# Altium project MCU_Board_fNIRS.PrjPcb
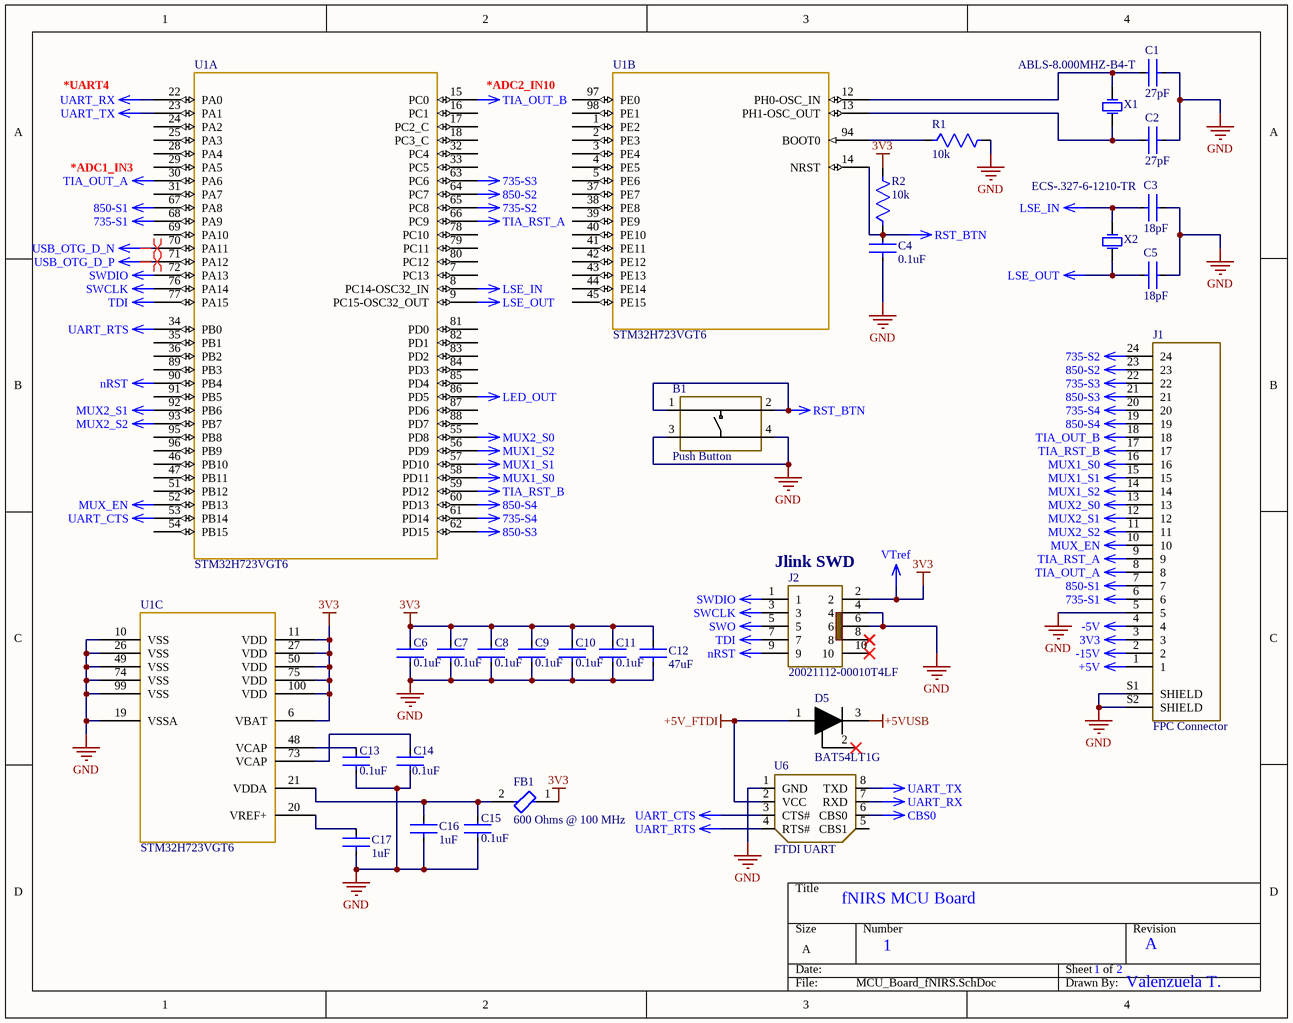
[diagram p0: MCU_Board_fNIRS.SchDoc]
2 sheets, 53 parts. Net scope: global (net labels, ports and power ports of the same name join across sheets).
Board file: MCU_Board_fNIRS.PcbDoc
Sheets:
  MCU_Board_fNIRS.SchDoc
  MCU_Board_fNIRS_POWER.SchDoc

## Sheet MCU_Board_fNIRS.SchDoc
size A; SheetNumber: 1; SheetTotal: 2

### Parts
B1  Push Button  [PTS810]
C1  27pF  [CAPC3216X180N]
C2  27pF  [CAPC3216X180N]
C3  18pF  [CAPC3216X180N]
C4  0.1uF  [CAPC3216X180N]
C5  18pF  [CAPC3216X180N]
C6  0.1uF  [CAPC3216X180N]
C7  0.1uF  [CAPC3216X180N]
C8  0.1uF  [CAPC3216X180N]
C9  0.1uF  [CAPC3216X180N]
C10  0.1uF  [CAPC3216X180N]
C11  0.1uF  [CAPC3216X180N]
C12  47uF  [CAPC3216X180N]
C13  0.1uF  [CAPC3216X180N]
C14  0.1uF  [CAPC3216X180N]
C15  0.1uF  [CAPC3216X180N]
C16  1uF  [CAPC1206(3216)130_M]
C17  1uF  [CAPC1206(3216)130_M]
D5  BAT54LT1G  [BAT54LT1]
FB1  600 Ohms @ 100 MHz  [BEADC1608X95N]
J1  FPC Connector  [TE_FPC]
J2  20021112-00010T4LF  [AMPHENOL_20021112-00010T4LF]
R1  10k  [R1206]
R2  10k  [R1206]
U1  STM32H723VGT6  [LQFP100_STM]  (parts A,B,C of 3)
U6  FTDI UART  [UB232R]
X1  ABLS-8.000MHZ-B4-T  [ABRA-ABLS-14.7456MHZ-B2-T_V]
X2  ECS-.327-6-1210-TR  [ECS-.327-6-1210-TR]

### Nets
3V3: C6.2 C7.2 C8.2 C9.2 C10.2 C11.2 C12.2 FB1.1 J1.3 J2.2 R2.2 U1.6(VBAT) U1.11(VDD) U1.27(VDD) U1.50(VDD) U1.75(VDD) U1.100(VDD)  [also labelled VTref]
735-S1: J1.6 U1.68(PA9)
735-S2: J1.24 U1.65(PC8)
735-S3: J1.22 U1.63(PC6)
735-S4: J1.20 U1.61(PD14)
850-S1: J1.7 U1.67(PA8)
850-S2: J1.23 U1.64(PC7)
850-S3: J1.21 U1.62(PD15)
850-S4: J1.19 U1.60(PD13)
+5V: J1.1
+5V_FTDI: D5.1(A) U6.2(VCC)
+5VUSB: D5.3(K)
-5V: J1.4
-15V: J1.2
CBS0: U6.6(CBS0)
GND: B1.3 B1.4 C1.1 C2.1 C3.2 C4.1 C5.2 C6.1 C7.1 C8.1 C9.1 C10.1 C11.1 C12.1 C13.1 C14.1 C15.1 C16.1 C17.1 J1.5 J1.S1(SHIELD) J1.S2(SHIELD) J2.4 J2.6 R1.2 U1.10(VSS) U1.19(VSSA) U1.26(VSS) U1.49(VSS) U1.74(VSS) U1.99(VSS) U6.1(GND)
LED_OUT: U1.86(PD5)
LSE_IN: C3.1 U1.8(PC14-OSC32_IN) X2.2(X2)
LSE_OUT: C5.1 U1.9(PC15-OSC32_OUT) X2.1(X1)
MUX1_S0: J1.16 U1.58(PD11)
MUX1_S1: J1.15 U1.57(PD10)
MUX1_S2: J1.14 U1.56(PD9)
MUX2_S0: J1.13 U1.55(PD8)
MUX2_S1: J1.12 U1.92(PB6)
MUX2_S2: J1.11 U1.93(PB7)
MUX_EN: J1.10 U1.52(PB13)
nRST: J2.9 U1.90(PB4)
RST_BTN: B1.1 B1.2 C4.2 R2.1 U1.14(NRST)
SWCLK: J2.3 U1.76(PA14)
SWDIO: J2.1 U1.72(PA13)
SWO: J2.5
TDI: J2.7 U1.77(PA15)
TIA_OUT_A: J1.8 U1.30(PA6)
TIA_OUT_B: J1.18 U1.15(PC0)
TIA_RST_A: J1.9 U1.66(PC9)
TIA_RST_B: J1.17 U1.59(PD12)
UART_CTS: U1.53(PB14) U6.3(CTS#)
UART_RTS: U1.34(PB0) U6.4(RTS#)
UART_RX: U1.22(PA0) U6.7(RXD)
UART_TX: U1.23(PA1) U6.8(TXD)
USB_OTG_D_N: U1.70(PA11)
USB_OTG_D_P: U1.71(PA12)
NetC1_2: C1.2 U1.12(PH0-OSC_IN) X1.1(X1)
NetC2_2: C2.2 U1.13(PH1-OSC_OUT) X1.2(X2)
NetC13_2: C13.2 U1.48(VCAP)
NetC14_2: C14.2 U1.73(VCAP)
NetC15_2: C15.2 C16.2 FB1.2 U1.21(VDDA)
NetC17_2: C17.2 U1.20(VREF+)
NetR1_1: R1.1 U1.94(BOOT0)

Not connected (* = marked no-connect by the designer): D5 2(NC)*; J2 8* 10*; U1 1(PE2) 2(PE3) 3(PE4) 4(PE5) 5(PE6) 7(PC13) 16(PC1) 17(PC2_C) 18(PC3_C) 24(PA2) 25(PA3) 28(PA4) 29(PA5) 31(PA7) 32(PC4) 33(PC5) 35(PB1) 36(PB2) 37(PE7) 38(PE8) 39(PE9) 40(PE10) 41(PE11) 42(PE12) 43(PE13) 44(PE14) 45(PE15) 46(PB10) 47(PB11) 51(PB12) 54(PB15) 69(PA10) 78(PC10) 79(PC11) 80(PC12) 81(PD0) 82(PD1) 83(PD2) 84(PD3) 85(PD4) 87(PD6) 88(PD7) 89(PB3) 91(PB5) 95(PB8) 96(PB9) 97(PE0) 98(PE1); U6 5(CBS1)

### Layout directives
differential pair: USB_OTG_D_N, USB_OTG_D_P

### Notes on the sheet
- *UART4
- (near U1) *ADC2_IN10
- *ADC1_IN3
- (near J2) Jlink SWD
- fNIRS MCU Board
- 1
- 2
- A
- Valenzuela T.

### Library data of the parts
B1 = PTS810 SJG 250 SMTR LFS: Tactile Switch SPST-NO Top Actuated Surface Mount
C1 C2 = C1206C270K5GAC7800: CAP CER 27PF 50V C0G/NP0 1206; Tolerance: -20% to +80%; Value: 1uF; Case-Metric: 3216; Rated Voltage: 25 V; Case-EIA: 1206; Max Thickness: 1.3 mm; Technology: SMT
C3 C5 = C1206C180J5GAC7800: 18 pF ±5% 50V Ceramic Capacitor C0G, NP0 1206 (3216 Metric); Tolerance: -20% to +80%; Value: 1uF; Case-Metric: 3216; Rated Voltage: 25 V; Case-EIA: 1206; Max Thickness: 1.3 mm; Technology: SMT
C4 C6-C11 C13-C15 = C1206C104K5RAC7210: 1206; Manufacturer: KEMET; Tolerance: 0.1; Material: Ceramic; Voltage Rating: 50 V; Temperature Characteristic: X7R; Automotive Grade: Grade 0; Capacitance: 0.10 μF; Value: 0.10 μF; Temperature Coefficient: 15%; Device Class L3: Ceramic Capacitors; ComponentLink2URL: https://content.kemet.com/datasheets/KEM_C1007_X8R_ULTRA_150C_SMD.pdf; Temperature Range Low: -55°C; RoHS: TRUE; Temperature Range High: +150°C; Automotive: Yes; Height: 0.88mm; Manufacturer Part Number: C1206C104K5RAC7210; Temperature: -55°C to +150°C; Octopart: https://octopart.com/c1206c104k5rac7210-kemet-3919856; Package: C1206C-EB; Mouser Description: Multilayer Ceramic Capacitors MLCC - SMD/SMT 50volts 0.1uF X7R 10%; Ipc Land Pattern Name: CAPC320160X78; Device Class L2: Capacitors; Category: Cap; Lead Free: Yes; ComponentLink2Description: Datasheet; Digikey Description: CAP CER 0.1UF 50V X7R 1206; Device Class L1: Passive Components
C12 = CL31A476MQHNNWE: 47 µF ±20% 6.3V Ceramic Capacitor X5R 1206 (3216 Metric); Tolerance: -20% to +80%; Value: 1uF; Case-Metric: 3216; Rated Voltage: 25 V; Case-EIA: 1206; Max Thickness: 1.3 mm; Technology: SMT
C16 = 12063G105ZAT4A_1: CAP 1uF 25V -20% to +80% 1206 (3216 Metric) Thickness 1.3mm SMD / C1206C105Z3VAC7800; Case-Metric: 3216; Case-EIA: 1206; Tolerance: -20% to +80%; Value: 1uF; Max Thickness: 1.3 mm; Technology: SMT; Rated Voltage: 25 V
C17 = 12063G105ZAT4A_1: CAP 1uF 25V -20% to +80% 1206 (3216 Metric) Thickness 1.3mm SMD; Case-Metric: 3216; Case-EIA: 1206; Tolerance: -20% to +80%; Value: 1uF; Max Thickness: 1.3 mm; Technology: SMT; Rated Voltage: 25 V
D5 = BAT54L: Schottky Barrier Diode, 3-Pin SOT-23, Pb-Free, Tape and Reel; Manufacturer: On Semiconductor; IFSM Max (A): 0.6; Configuration: Single; trr Max (ns): 5; PackageVersion: Rev. AP, 11/2009; ComponentLink3Description: Package Specification; RoHS: TRUE; ComponentLink3URL: http://www.onsemi.cn/pub_link/Collateral/318-08.PDF; PackageDescription: 3-Pin Small Outline Transistor, Body 2.92 x 1.3 mm, Pitch 0.95 mm; DatasheetVersion: Rev. 12; ComponentLink1Description: Manufacturer URL; PartNumber: BAT54LT1G; ComponentLink2Description: Datasheet; Mounting Technology: Surface Mount; PackageReference: SOT-23-3-318-08; ComponentLink2URL: http://www.onsemi.cn/pub_link/Collateral/BAT54LT1-D.PDF; ComponentLink1URL: http://www.onsemi.com/; Packing: Tape and Reel
FB1 = FCM 1608KF-601T03: 600 Ohms @ 100 MHz 1 Ferrite Bead 0603 (1608 Metric) 350mA 500mOhm; Tolerance: -20% to +80%; Value: 1uF; Case-Metric: 3216; Rated Voltage: 25 V; Case-EIA: 1206; Max Thickness: 1.3 mm; Technology: SMT
J1 = 2-1734592-4: 24 Position FPC Connector Contacts, Bottom 0.020" _0.50mm_ Surface Mount, Right Angle; MF: TE Connectivity; MP: 2-1734592-4; Value: *; Package: None; Price: None; SnapEDA_Link: https://www.snapeda.com/parts/2-1734592-4/TE%20Connectivity/view-part/4788511/?ref=snap; Availability: Unavailable
J2 = 20021112-00010T4LF: Connector Header Through Hole, Right Angle 10 position 0.050" (1.27mm); MF: Amphenol; Package: None; Price: None; Check_prices: https://www.snapeda.com/parts/20021112-00010T4LF/Amphenol/view-part/?ref=eda; Value: *; SnapEDA_Link: https://www.snapeda.com/parts/20021112-00010T4LF/Amphenol/view-part/?ref=snap; MP: 20021112-00010T4LF; Availability: In Stock; Purchase-URL: https://pricing.snapeda.com/search?q=20021112-00010T4LF&ref=eda
R1 R2 = RC1206FR-0710KL: 1206 10kOhm
U1 = STM32H723VGT6: No Description Available; Mfr_Name: STMicroelectronics; RefDes: RefDes; Type: Type
U6 = UB232R: FT232R - USB 2.0 to UART (RS232) Bridge Interface Evaluation Board
X1 = ABLS-8.000MHZ-B4-T: Low Profile Crystal, 8.0 MHz, +/- 30 ppm, -20 to 70 degC, 2-Pin SMD, RoHS, Tape and Reel; Brand: ABRACON; Case Length: 11.4mm; Frequency Stability: 50PPM; ESR: 80Ohms; Case Height: 4.2mm; Tolerance: 30PPM; Frequency: 8MHz; Case Width: 4.7mm; Load Capacitance: 18pF; Datasheet Version: 04/2011; Termination Style: SMD/SMT; Dimensions: 4.7mmWx11.4mmLx4.2mmH; Packaging: Reel; Manufacturer: ABRACON; Package URL: http://www.abracon.com/Support/PackageDrawing/Resonators/ABLS-2D.pdf; Mounting Technology: SurfaceMount; Package Reference: ABLS-14.7456MHZ-B2-T; Product Category: Crystals; Package Description: 2-Pin Surface Mount Device, Body 11.4 x 4.7 mm; Package / Case: HC-49/US; Mounting Style: SMD/SMT; Operating Temperature Range: -20Cto+70C; Series: ABLS; Factory Pack Quantity: 1000; Datasheet URL: http://www.abracon.com/Resonators/abls.pdf; Manufacturer URL: http://www.abracon.com/; RoHS: Details; Type: LowProfileMicroprocessorCrystal
X2 = ECS-.327-6-1210-TR: Low Profile Crystal, 8.0 MHz, +/- 30 ppm, -20 to 70 degC, 2-Pin SMD, RoHS, Tape and Reel; Brand: ABRACON; Case Length: 11.4mm; Frequency Stability: 50PPM; ESR: 80Ohms; Case Height: 4.2mm; Tolerance: 30PPM; Frequency: 8MHz; Case Width: 4.7mm; Load Capacitance: 18pF; Datasheet Version: 04/2011; Termination Style: SMD/SMT; Dimensions: 4.7mmWx11.4mmLx4.2mmH; Packaging: Reel; Manufacturer: ABRACON; Package URL: http://www.abracon.com/Support/PackageDrawing/Resonators/ABLS-2D.pdf; Mounting Technology: SurfaceMount; Package Reference: ABLS-14.7456MHZ-B2-T; Product Category: Crystals; Package Description: 2-Pin Surface Mount Device, Body 11.4 x 4.7 mm; Package / Case: HC-49/US; Mounting Style: SMD/SMT; Operating Temperature Range: -20Cto+70C; Series: ABLS; Factory Pack Quantity: 1000; Datasheet URL: http://www.abracon.com/Resonators/abls.pdf; Manufacturer URL: http://www.abracon.com/; RoHS: Details; Type: LowProfileMicroprocessorCrystal

## Sheet MCU_Board_fNIRS_POWER.SchDoc
size A; SheetNumber: 2; SheetTotal: 2
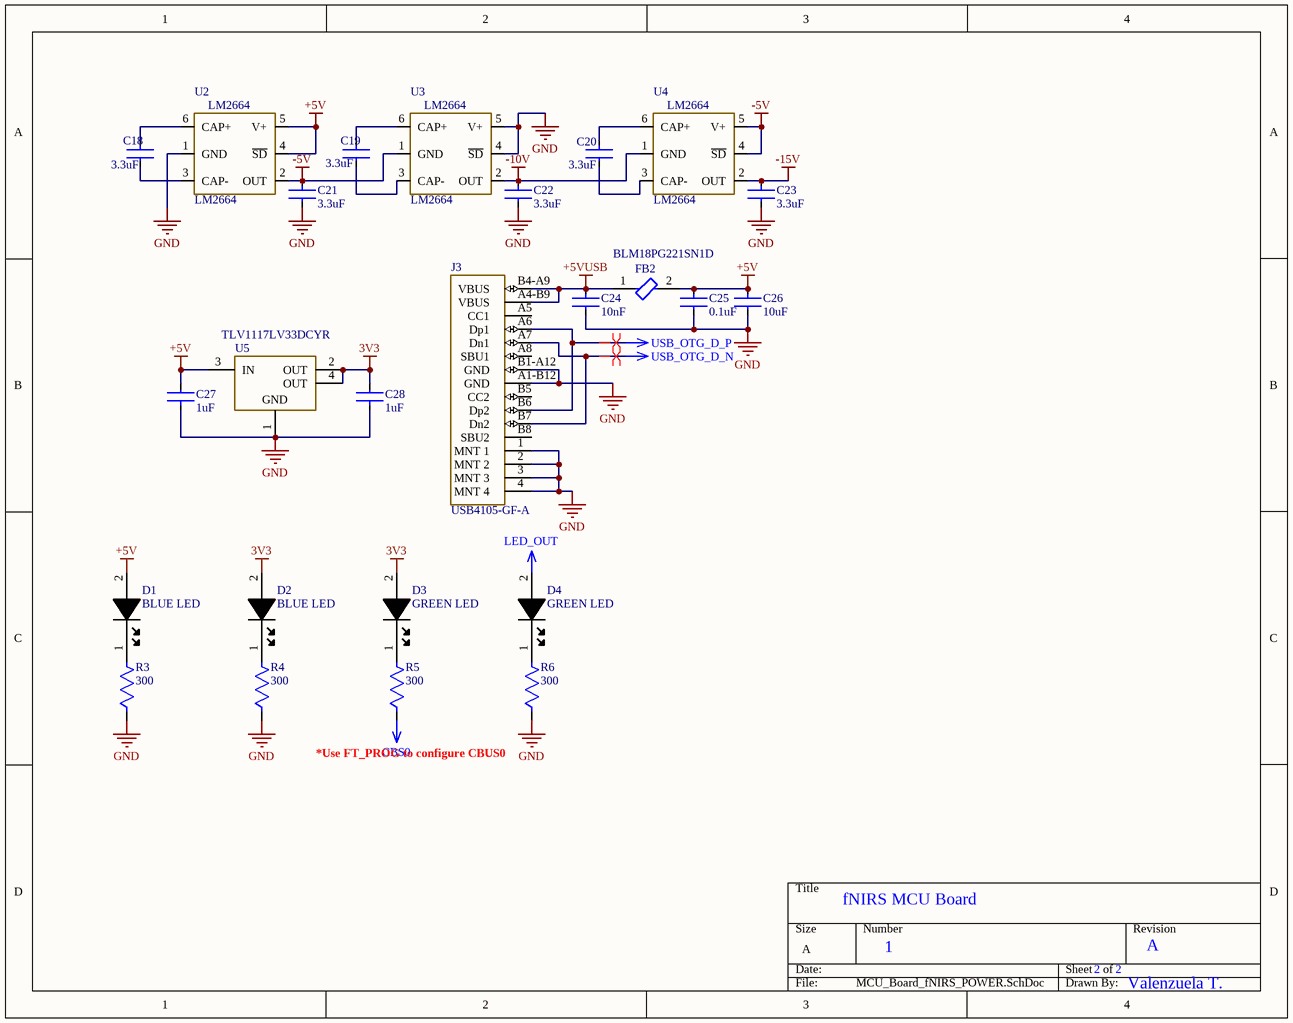
[diagram p1: MCU_Board_fNIRS_POWER.SchDoc]

### Parts
C18  3.3uF  [CAPC1210(3225)190_M]
C19  3.3uF  [CAPC1210(3225)190_M]
C20  3.3uF  [CAPC1210(3225)190_M]
C21  3.3uF  [CAPC1210(3225)190_M]
C22  3.3uF  [CAPC1210(3225)190_M]
C23  3.3uF  [CAPC1210(3225)190_M]
C24  10nF  [CAPC1206(3216)130_M]
C25  0.1uF  [CAPC3216X180N]
C26  10uF  [CAPC3216X180N]
C27  1uF  [CAPC3216X180N]
C28  1uF  [CAPC3216X180N]
D1  BLUE LED  [XZCFBB54W-1VF]
D2  BLUE LED  [XZCFBB54W-1VF]
D3  GREEN LED  [XZCFBB54W-1VF]
D4  GREEN LED  [XZCFBB54W-1VF]
FB2  BLM18PG221SN1D  [BEADC1608X95N]
J3  USB4105-GF-A  [FP-USB4105-GF-A-MFG]
R3  300  [R1206]
R4  300  [R1206]
R5  300  [R1206]
R6  300  [R1206]
U2  LM2664  [LM2664]
U3  LM2664  [LM2664]
U4  LM2664  [LM2664]
U5  TLV1117LV33DCYR  [DCY0004A_M]

### Nets
3V3: C28.2 D2.2 D3.2 U5.2(OUT) U5.4(OUT)
+5V: C25.1 C26.1 C27.2 D1.2 FB2.2 U2.4(~{SD}) U2.5(V+) U5.3(IN)
+5VUSB: C24.1 FB2.1 J3.A4-B9(VBUS) J3.B4-A9(VBUS)
-5V: C21.1 U2.2(OUT) U3.1(GND) U4.4(~{SD}) U4.5(V+)
-10V: C22.1 U3.2(OUT) U4.1(GND)
-15V: C23.1 U4.2(OUT)
CBS0: R5.1
GND: C21.2 C22.2 C23.2 C24.2 C25.2 C26.2 C27.1 C28.1 J3.1(MNT_1) J3.2(MNT_2) J3.3(MNT_3) J3.4(MNT_4) J3.A1-B12(GND) J3.B1-A12(GND) R3.1 R4.1 R6.1 U2.1(GND) U3.4(~{SD}) U3.5(V+) U5.1(GND)
LED_OUT: D4.2
USB_OTG_D_N: J3.A7(Dn1) J3.B7(Dn2)
USB_OTG_D_P: J3.A6(Dp1) J3.B6(Dp2)
NetC18_1: C18.1 U2.6(CAP+)
NetC18_2: C18.2 U2.3(CAP-)
NetC19_1: C19.1 U3.6(CAP+)
NetC19_2: C19.2 U3.3(CAP-)
NetC20_1: C20.1 U4.6(CAP+)
NetC20_2: C20.2 U4.3(CAP-)
NetD1_1: D1.1 R3.2
NetD2_1: D2.1 R4.2
NetD3_1: D3.1 R5.2
NetD4_1: D4.1 R6.2

Not connected (* = marked no-connect by the designer): J3 A5(CC1) A8(SBU1) B5(CC2) B8(SBU2)

### Layout directives
differential pair: USB_OTG_D_N, USB_OTG_D_P

### Notes on the sheet
- *Use FT_PROG to configure CBUS0
- fNIRS MCU Board
- 1
- 2
- A
- Valenzuela T.

### Library data of the parts
C18-C23 = C1210C335K5RAC7800: 1210
C24 = C1206C103KMREC7800: 10000 pF ±10% 63V Ceramic Capacitor X7R 1206 (3216 Metric); Tolerance: -20% to +80%; Value: 1uF; Case-Metric: 3216; Rated Voltage: 25 V; Case-EIA: 1206; Max Thickness: 1.3 mm; Technology: SMT
C25 = C1206C104K5RAC7210: as C4 on sheet MCU_Board_fNIRS; Device Class L3: Ceramic Capacitors; ComponentLink2URL: https://content.kemet.com/datasheets/KEM_C1007_X8R_ULTRA_150C_SMD.pdf; Temperature Range Low: -55°C; RoHS: TRUE; Temperature Range High: +150°C; Automotive: Yes; Height: 0.88mm; Manufacturer Part Number: C1206C104K5RAC7210; Temperature: -55°C to +150°C; Octopart: https://octopart.com/c1206c104k5rac7210-kemet-3919856; Package: C1206C-EB; Mouser Description: Multilayer Ceramic Capacitors MLCC - SMD/SMT 50volts 0.1uF X7R 10%; Ipc Land Pattern Name: CAPC320160X78; Device Class L2: Capacitors; Category: Cap; Lead Free: Yes; ComponentLink2Description: Datasheet; Digikey Description: CAP CER 0.1UF 50V X7R 1206; Device Class L1: Passive Components
C26 = CL31B106KOHNNWE: 1206
C27 C28 = 12063G105ZAT4A: CAP 1uF 25V -20% to +80% 1206 (3216 Metric) Thickness 1.3mm; Case-Metric: 3216; Case-EIA: 1206; Tolerance: -20% to +80%; Value: 1uF; Max Thickness: 1.3 mm; Technology: SMT; Rated Voltage: 25 V
D1 D2 = XZCFBB54W-1VF: Blue 470nm LED Indication - Discrete 2.65V 0805 (2012 Metric)
D3 D4 = XZCDGK54W-1VF: Green 525nm LED Indication - Discrete 2.65V 0805 (2012 Metric)
FB2 = BLM18PG221SN1D: 220 Ohms @ 100 MHz 1 Power Line Ferrite Bead 0603 (1608 Metric) 1.4A 100mOhm; Tolerance: -20% to +80%; Value: 1uF; Case-Metric: 3216; Rated Voltage: 25 V; Case-EIA: 1206; Max Thickness: 1.3 mm; Technology: SMT
J3 = USB4105-GF-A: CONN RCPT USB2.0 TYPEC 5A; Manufacturer: GCT; Voltage Rating: 20V; Is Female: yes; Current Rating: 5/6.25/1.25/0.25A; Number Of Contacts: 16; Conn Orientation: Right Angle; Device Class L1: Connectors; Category: Conn; Lead Free: Yes; RoHS: TRUE; Temperature Range High: +85°C; Digikey Description: CONN RCPT USB2.0 TYPEC 5A; Device Class L3: unset; ComponentLink2Description: Datasheet; Manufacturer Part Number: USB4105-GF-A; Package: 0; Usb Standard: USB 2.0; Device Class L2: USB Connectors; Automotive: No; Temperature Range Low: -40°C; Height: 3.46mm; Temperature: -40°C to +85°C; Contact Material: Gold,Nickel; ComponentLink2URL: https://gct.co/files/drawings/usb4105.pdf; Octopart: https://octopart.com/usb4105-gf-a-gct-106627878
R3 R4 R6 = CRCW1206300RFKEA: 300 Ohms ±1% 0.25W, 1/4W Chip Resistor 1206 (3216 Metric) Automotive AEC-Q200 Thick Film
R5 = CRCW1206300RFKEA
U2-U4 = LM2664: Switched Capacitor Voltage Converter, 6-pin SOT-23; Manufacturer: Texas Instruments; CompType: Switch Caps; PackageTopMarking: S03A*XTT; PowerWise: N; PackageDescription: Molded SOT-23, .115 x .063 x .040in Body, 6 Lead, .0375in in Pitch; Code_IPC: SOT26A-6; PinCount: 6; PackageReference: DBV0006A; ComponentLink1URL: http://www.ti.com/general/docs/lit/getliterature.tsp?genericPartNumber=LM2664&fileType=pdf; Code_JEDEC: MO-178-AB; ComponentLink1Description: Datasheet URL; RoHS: N
U5 = CMP-0395-00503-2: Single Output LDO, 1 A, Fixed 3.3 V Output, 2 to 5.5 V Input, 4-pin SOT-223 (DCY), -40 to 125 degC, Green (RoHS & no Sb/Br); Manufacturer: Texas Instruments; Vout Adj(Min)(V): 3.3; Vdo(Typ)(mV): 1200; Iq(Typ)(mA): 0.05; Accuracy(%): 2; Iout(Max)(A): 1; SubFamily: Single Channel LDO; Vin(Max)(V): 5.5; PackageReference: DCY0004A; PackageDescription: 4-Pin Plastic Small Outline, Body 3.5 x 6.5 mm, Pitch 2.3 mm; Vout Adj(Max)(V): 3.3; Mounting Technology: Surface Mount; ComponentLink2Description: Datasheet; ComponentLink1Description: Manufacturer URL; PartNumber: TLV1117LV33DCYR; ComponentLink3Description: Package Specification; ComponentLink1URL: http://www.ti.com/; ComponentLink2URL: http://www.ti.com/general/docs/lit/getliterature.tsp?genericPartNumber=TLV1117LV33&fileType=pdf; Fixed Output Options(V): 3.3; PackageVersion: 4202506/B; Vin(Min)(V): 2; DatasheetVersion: SBVS160A; Eco-Plan: Green (RoHS & no Sb/Br); ComponentLink3URL: http://www.ti.com/litv/pdf/mpds094a; Code_JEDEC: TO-261

## Nets that join several sheets
3V3: MCU_Board_fNIRS (17 pins), MCU_Board_fNIRS_POWER (5 pins)
+5V: MCU_Board_fNIRS (J1.1), MCU_Board_fNIRS_POWER (8 pins)
+5VUSB: MCU_Board_fNIRS (D5.3), MCU_Board_fNIRS_POWER (C24.1 FB2.1 J3.A4-B9 J3.B4-A9)
-5V: MCU_Board_fNIRS (J1.4), MCU_Board_fNIRS_POWER (5 pins)
-15V: MCU_Board_fNIRS (J1.2), MCU_Board_fNIRS_POWER (C23.1 U4.2)
CBS0: MCU_Board_fNIRS (U6.6), MCU_Board_fNIRS_POWER (R5.1)
GND: MCU_Board_fNIRS (32 pins), MCU_Board_fNIRS_POWER (21 pins)
LED_OUT: MCU_Board_fNIRS (U1.86), MCU_Board_fNIRS_POWER (D4.2)
USB_OTG_D_N: MCU_Board_fNIRS (U1.70), MCU_Board_fNIRS_POWER (J3.A7 J3.B7)
USB_OTG_D_P: MCU_Board_fNIRS (U1.71), MCU_Board_fNIRS_POWER (J3.A6 J3.B6)